# EAGLE design TelTail Breakout 3v0 (EAGLE 9.6.2)
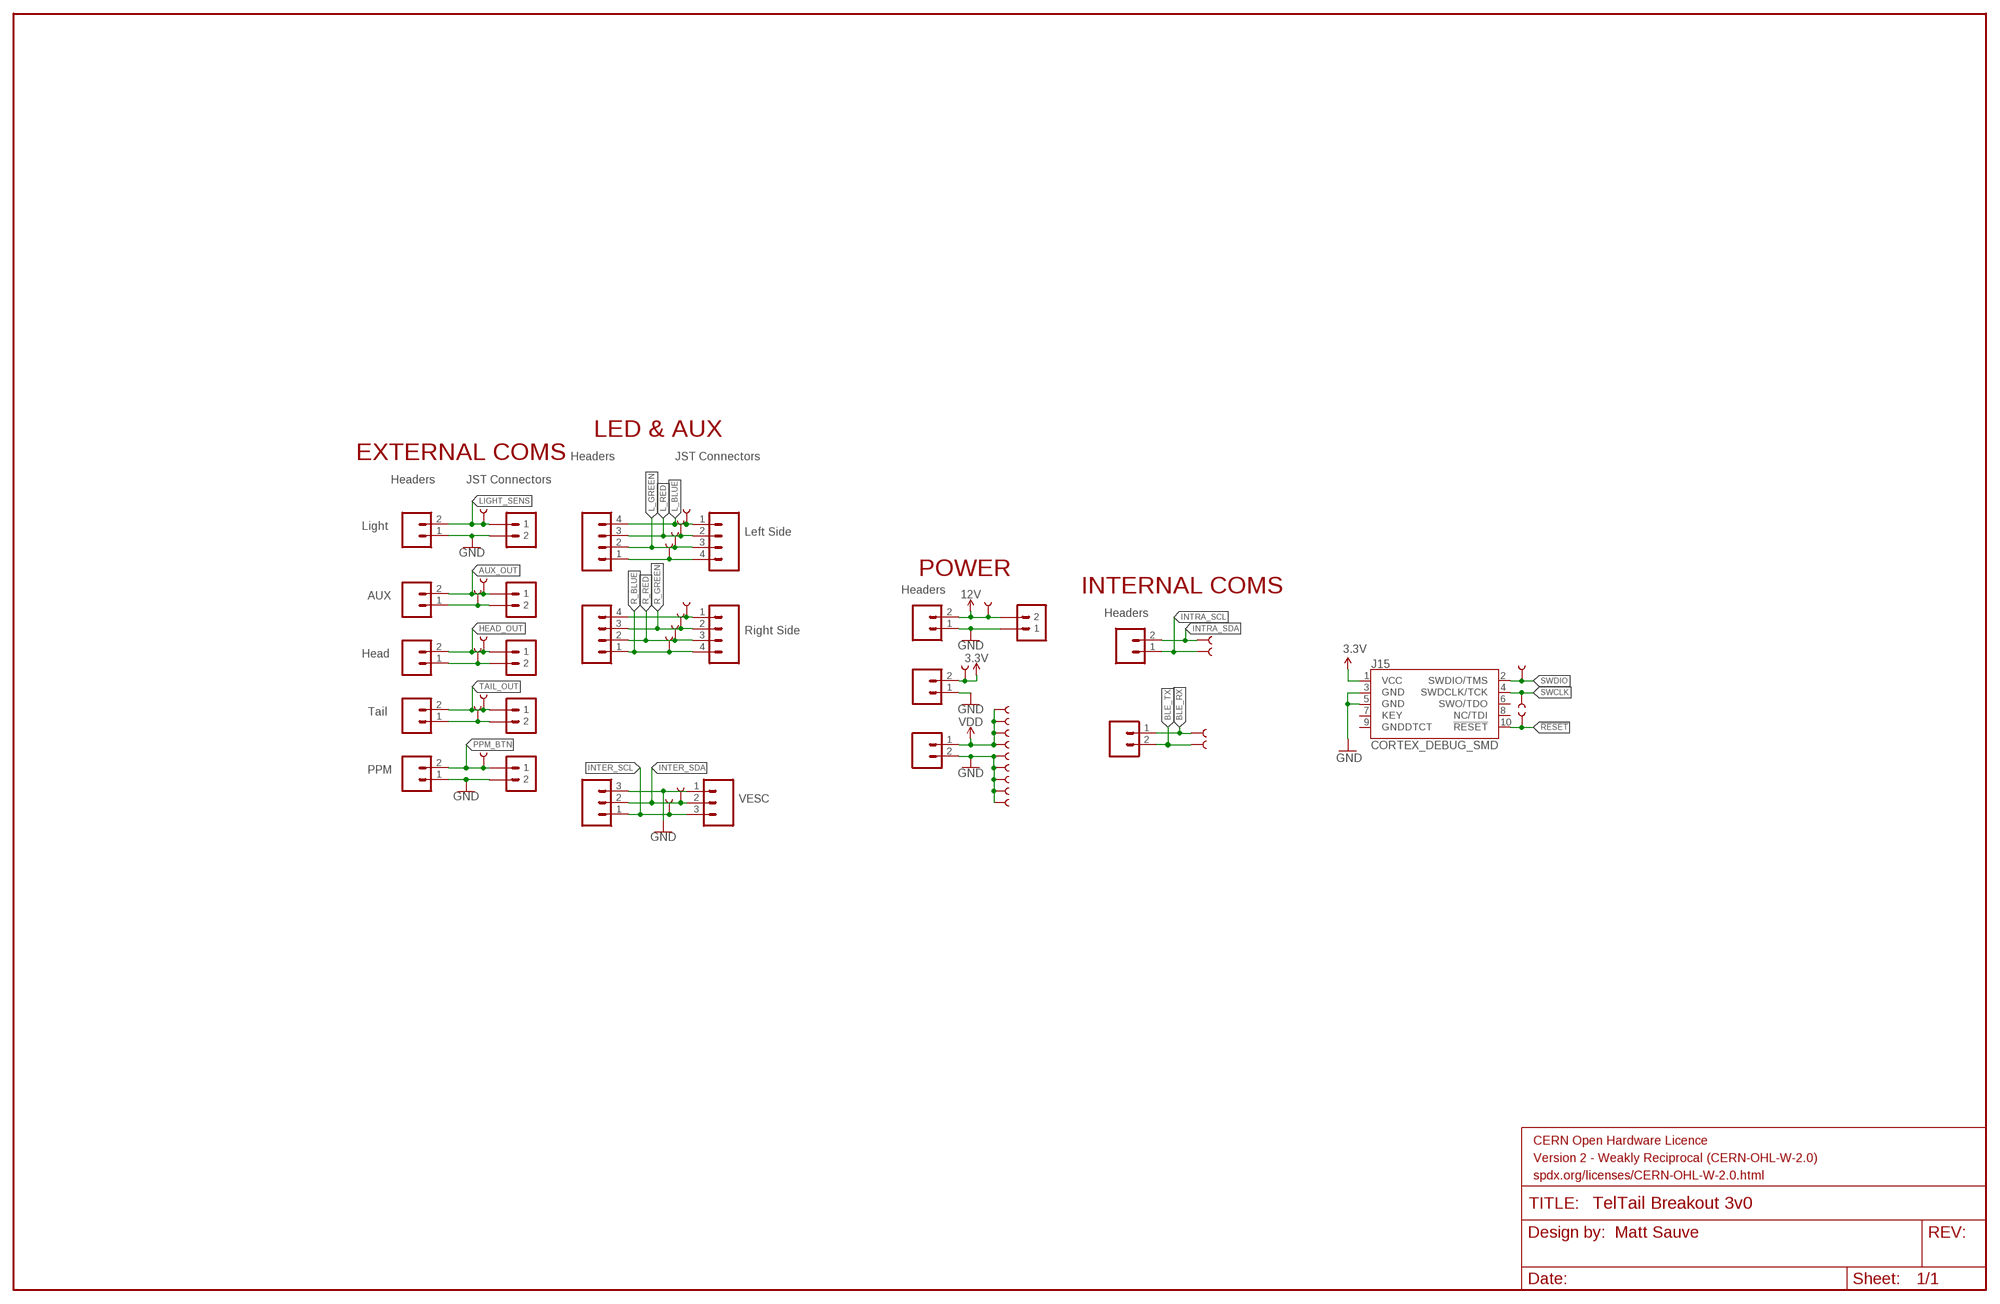
[diagram p0: schematic, sheet 1]

## Parts
FRAME1  FRAME-LEDGER_CERN_WEAK  [CERN_WEAK]
J1  CONN_02  [1X02]
J2  CONN_02  [1X02]
J3  CONN_02  [1X02]
J4  CONN_02  [1X02]
J5  CONN_02  [1X02]
J6  CONN_02  [1X02]
J7  CONN_03  [1X03]
J9  CONN_04  [1X04]
J10  CONN_04  [1X04]
J11  CONN_02  [1X02]
J12  CONN_02  [1X02]
J13  CONN_02  [1X02]
J14  CONN_02  [1X02]
J15  CORTEX_DEBUG_SMD  [SAMTECH_FTSH-105-01]
U$1  JST_PH_2POS  [JST_PH_2POS]
U$2  JST_PH_2POS  [JST_PH_2POS]
U$3  JST_PH_2POS  [JST_PH_2POS]
U$4  JST_PH_2POS  [JST_PH_2POS]
U$5  JST_PH_2POS  [JST_PH_2POS]
U$6  POGO_PIN_90173-AS  [POGO_PIN_90173-AS]
U$8  JST_PH_4POS  [JST_PH_4POS]
U$9  JST_PH_3POS  [JST_PH_3POS]
U$10  JST_PH_4POS  [JST_PH_4POS]
U$11  POGO_PIN_90173-AS  [POGO_PIN_90173-AS]
U$12  POGO_PIN_90173-AS  [POGO_PIN_90173-AS]
U$13  POGO_PIN_90173-AS  [POGO_PIN_90173-AS]
U$14  POGO_PIN_90173-AS  [POGO_PIN_90173-AS]
U$15  POGO_PIN_90173-AS  [POGO_PIN_90173-AS]
U$16  POGO_PIN_90173-AS  [POGO_PIN_90173-AS]
U$17  POGO_PIN_90173-AS  [POGO_PIN_90173-AS]
U$18  POGO_PIN_90173-AS  [POGO_PIN_90173-AS]
U$19  POGO_PIN_90173-AS  [POGO_PIN_90173-AS]
U$20  POGO_PIN_90173-AS  [POGO_PIN_90173-AS]
U$21  POGO_PIN_90173-AS  [POGO_PIN_90173-AS]
U$22  POGO_PIN_90173-AS  [POGO_PIN_90173-AS]
U$23  POGO_PIN_90173-AS  [POGO_PIN_90173-AS]
U$24  POGO_PIN_90173-AS  [POGO_PIN_90173-AS]
U$25  POGO_PIN_90173-AS  [POGO_PIN_90173-AS]
U$26  POGO_PIN_90173-AS  [POGO_PIN_90173-AS]
U$27  POGO_PIN_90173-AS  [POGO_PIN_90173-AS]
U$28  POGO_PIN_90173-AS  [POGO_PIN_90173-AS]
U$29  POGO_PIN_90173-AS  [POGO_PIN_90173-AS]
U$30  POGO_PIN_90173-AS  [POGO_PIN_90173-AS]
U$31  POGO_PIN_90173-AS  [POGO_PIN_90173-AS]
U$32  POGO_PIN_90173-AS  [POGO_PIN_90173-AS]
U$33  POGO_PIN_90173-AS  [POGO_PIN_90173-AS]
U$34  POGO_PIN_90173-AS  [POGO_PIN_90173-AS]
U$35  POGO_PIN_90173-AS  [POGO_PIN_90173-AS]
U$36  POGO_PIN_90173-AS  [POGO_PIN_90173-AS]
U$37  POGO_PIN_90173-AS  [POGO_PIN_90173-AS]
U$38  POGO_PIN_90173-AS  [POGO_PIN_90173-AS]
U$39  POGO_PIN_90173-AS  [POGO_PIN_90173-AS]
U$40  POGO_PIN_90173-AS  [POGO_PIN_90173-AS]
U$42  POGO_PIN_90173-AS  [POGO_PIN_90173-AS]
U$43  POGO_PIN_90173-AS  [POGO_PIN_90173-AS]
U$44  POGO_PIN_90173-AS  [POGO_PIN_90173-AS]
U$45  JST_PH_2POS  [JST_PH_2POS]
U$46  POGO_PIN_90173-AS  [POGO_PIN_90173-AS]
U$48  POGO_PIN_90173-AS  [POGO_PIN_90173-AS]

## Nets
3.3V: J12.2 J15.1(VCC) U$20.P$1
12V: J11.2 U$38.P$1 U$45.2
!RESET: J15.10(!RESET) U$36.P$1
AUX_OUT: J2.2 U$4.1 U$31.P$1
BLE_RX: J14.1 U$46.P$1
BLE_TX: J14.2 U$48.P$1
GND: J1.1 J5.1 J6.2 J7.3 J11.1 J12.1 J15.3(GND) J15.5(GND) U$1.2 U$5.2 U$6.P$1 U$9.1 U$24.P$1 U$28.P$1 U$30.P$1 U$40.P$1 U$45.1
HEAD_OUT: J3.2 U$3.1 U$29.P$1
INTER_SCL: J7.1 U$9.3 U$19.P$1
INTER_SDA: J7.2 U$9.2 U$21.P$1
INTRA_SCL: J13.1 U$44.P$1
INTRA_SDA: J13.2 U$43.P$1
L_BLUE: J10.4 U$10.1 U$11.P$1
L_GREEN: J10.2 U$10.3 U$13.P$1
L_RED: J10.3 U$10.2 U$12.P$1
LIGHT_SENS: J1.2 U$5.1 U$33.P$1
N$1: J4.1 U$2.2 U$35.P$1
N$2: J3.1 U$3.2 U$34.P$1
N$3: J2.1 U$4.2 U$32.P$1
N$4: J10.1 U$10.4 U$14.P$1
N$5: J9.4 U$8.1 U$15.P$1
PPM_BTN: J5.2 U$1.1 U$25.P$1
R_BLUE: J9.1 U$8.4 U$18.P$1
R_GREEN: J9.3 U$8.2 U$16.P$1
R_RED: J9.2 U$8.3 U$17.P$1
SWCLK: J15.4(SWDCLK/TCK) U$37.P$1
SWDIO: J15.2(SWDIO/TMS) U$39.P$1
TAIL_OUT: J4.2 U$2.1 U$27.P$1
VDD: J6.1 U$22.P$1 U$23.P$1 U$26.P$1 U$42.P$1
Unconnected: J15.6(SWO/TDO) J15.7(KEY) J15.8(NC/TDI) J15.9(GNDDTCT)

## Notes on the sheet
- LED & AUX
- EXTERNAL COMS | Headers | JST Connectors
- Headers | JST Connectors
- Light
- Left Side
- POWER
- Headers | INTERNAL COMS
- AUX
- Headers
- Right Side
- Head
- Tail
- PPM
- VESC
- Matt Sauve

## Library data of the parts
FRAME1 = SAUVE:FRAME-LEDGER_CERN_WEAK: Schematic Frame - Ledger Standard 11x14 US Ledger frame
J1-J6 J11-J14 = SparkFun-Connectors:CONN_02: Multi connection point. Often used as Generic Header-pin footprint for 0.1 inch spaced/style header connections On any of the 0.1 inch spaced packages, you can populate with these: Break Away Headers - Straight <https://www.sparkfun.com/products/116> (PRT-00116) Break Away Male Headers - Right Angle <https://www.sparkfun.com/products/553> (PRT-00553) Female Headers <https://www.sparkfun.com/products/115> (PRT-00115) Break Away Headers - Machine Pin <https://www.sparkfun.com/products/117> (PRT-00117) Break Away Female Headers - Swiss Machine Pin <https://www.sparkfun.com/products/743> (PRT-00743) For SCREWTERMINALS and SPRING TERMINALS visit here: Screw Terimnals on SparkFun.com <https://www.sparkfun.com/search/results?term=Screw+Terminals> (5mm/3.5mm/2.54mm spacing) This device is also useful as a general connection point to wire up your design to another part of your project. Our various solder wires solder well into these plated through hole pads. Hook-Up Wire - Assortment (Stranded, 22 AWG) <https://www.sparkfun.com/products/11375> (PRT-11375) Hook-Up Wire - Assortment (Solid Core, 22 AWG) <https://www.sparkfun.com/products/11367> (PRT-11367) View the entire wire category on our website here <https://www.sparkfun.com/categories/141> Special notes: Molex polarized connector foot print use with: PRT-08233 with associated crimp pins and housings. 2.54_SCREWTERM for use with PRT-10571. 3.5mm Screw Terminal footprints for PRT-08084 5mm Screw Terminal footprints for use with PRT-08432
J7 = SparkFun-Connectors:CONN_03: Multi connection point. Often used as Generic Header-pin footprint for 0.1 inch spaced/style header connections On any of the 0.1 inch spaced packages, you can populate with these: Break Away Headers - Straight <https://www.sparkfun.com/products/116> (PRT-00116) Break Away Male Headers - Right Angle <https://www.sparkfun.com/products/553> (PRT-00553) Female Headers <https://www.sparkfun.com/products/115> (PRT-00115) Break Away Headers - Machine Pin <https://www.sparkfun.com/products/117> (PRT-00117) Break Away Female Headers - Swiss Machine Pin <https://www.sparkfun.com/products/743> (PRT-00743) Stackable Header - 3 Pin (Female, 0.1") <https://www.sparkfun.com/products/13875> (PRT-13875) For SCREWTERMINALS and SPRING TERMINALS visit here: Screw Terimnals on SparkFun.com <https://www.sparkfun.com/search/results?term=Screw+Terminals> (5mm/3.5mm/2.54mm spacing) This device is also useful as a general connection point to wire up your design to another part of your project. Our various solder wires solder well into these plated through hole pads. Hook-Up Wire - Assortment (Stranded, 22 AWG) <https://www.sparkfun.com/products/11375> (PRT-11375) Hook-Up Wire - Assortment (Solid Core, 22 AWG) <https://www.sparkfun.com/products/11367> (PRT-11367) View the entire wire category on our website here <https://www.sparkfun.com/categories/141> Special notes: Molex polarized connector foot print use with SKU : PRT-08232 with associated crimp pins and housings.
J9 J10 = SparkFun-Connectors:CONN_04: Multi connection point. Often used as Generic Header-pin footprint for 0.1 inch spaced/style header connections On any of the 0.1 inch spaced packages, you can populate with these: Break Away Headers - Straight <https://www.sparkfun.com/products/116> (PRT-00116) Break Away Male Headers - Right Angle <https://www.sparkfun.com/products/553> (PRT-00553) Female Headers <https://www.sparkfun.com/products/115> (PRT-00115) Break Away Headers - Machine Pin <https://www.sparkfun.com/products/117> (PRT-00117) Break Away Female Headers - Swiss Machine Pin <https://www.sparkfun.com/products/743> (PRT-00743) For SCREWTERMINALS and SPRING TERMINALS visit here: Screw Terimnals on SparkFun.com <https://www.sparkfun.com/search/results?term=Screw+Terminals> (5mm/3.5mm/2.54mm spacing) This device is also useful as a general connection point to wire up your design to another part of your project. Our various solder wires solder well into these plated through hole pads. Hook-Up Wire - Assortment (Stranded, 22 AWG) <https://www.sparkfun.com/products/11375> (PRT-11375) Hook-Up Wire - Assortment (Solid Core, 22 AWG) <https://www.sparkfun.com/products/11367> (PRT-11367) View the entire wire category on our website here <https://www.sparkfun.com/categories/141> Special notes: Molex polarized connector foot print use with SKU : PRT-08231 with associated crimp pins and housings. 1MM SMD Version SKU: PRT-10208; PROD_ID: CONN-09696
J15 = SparkFun-Connectors:CORTEX_DEBUG: Cortex Debug Connector - 10 pin Supports JTAG debug, Serial Wire debug, and Serial Wire Viewer. PTH and SMD connector options available. General Connector Information <http://infocenter.arm.com/help/topic/com.arm.doc.faqs/attached/13634/cortex_debug_connectors.pdf> Products: PTH Connector <http://www.digikey.com/product-detail/en/cnc-tech/3220-10-0100-00/1175-1627-ND/3883661> -via Digi-Key SparkFun PSoc <https://www.sparkfun.com/products/13229> SparkFun T <https://www.sparkfun.com/products/13810>
U$1-U$5 U$45 = SAUVE:JST_PH_2POS
U$6 U$11-U$40 U$42-U$44 U$46 U$48 = SAUVE:POGO_PIN_90173-AS
U$8 U$10 = SAUVE:JST_PH_4POS
U$9 = SAUVE:JST_PH_3POS

## Board
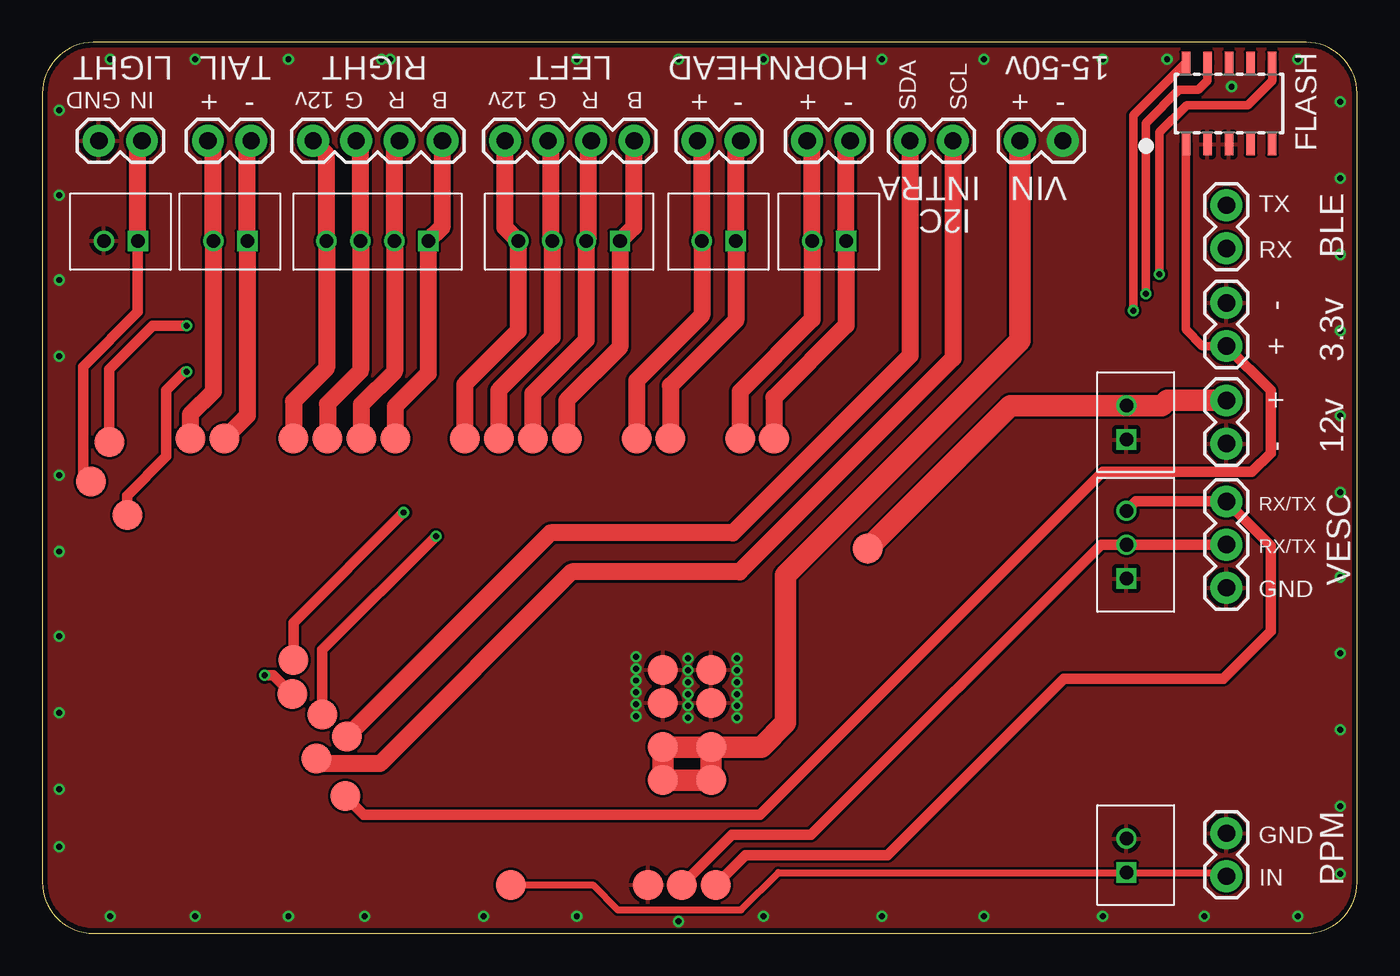
[diagram p1: board, top side]
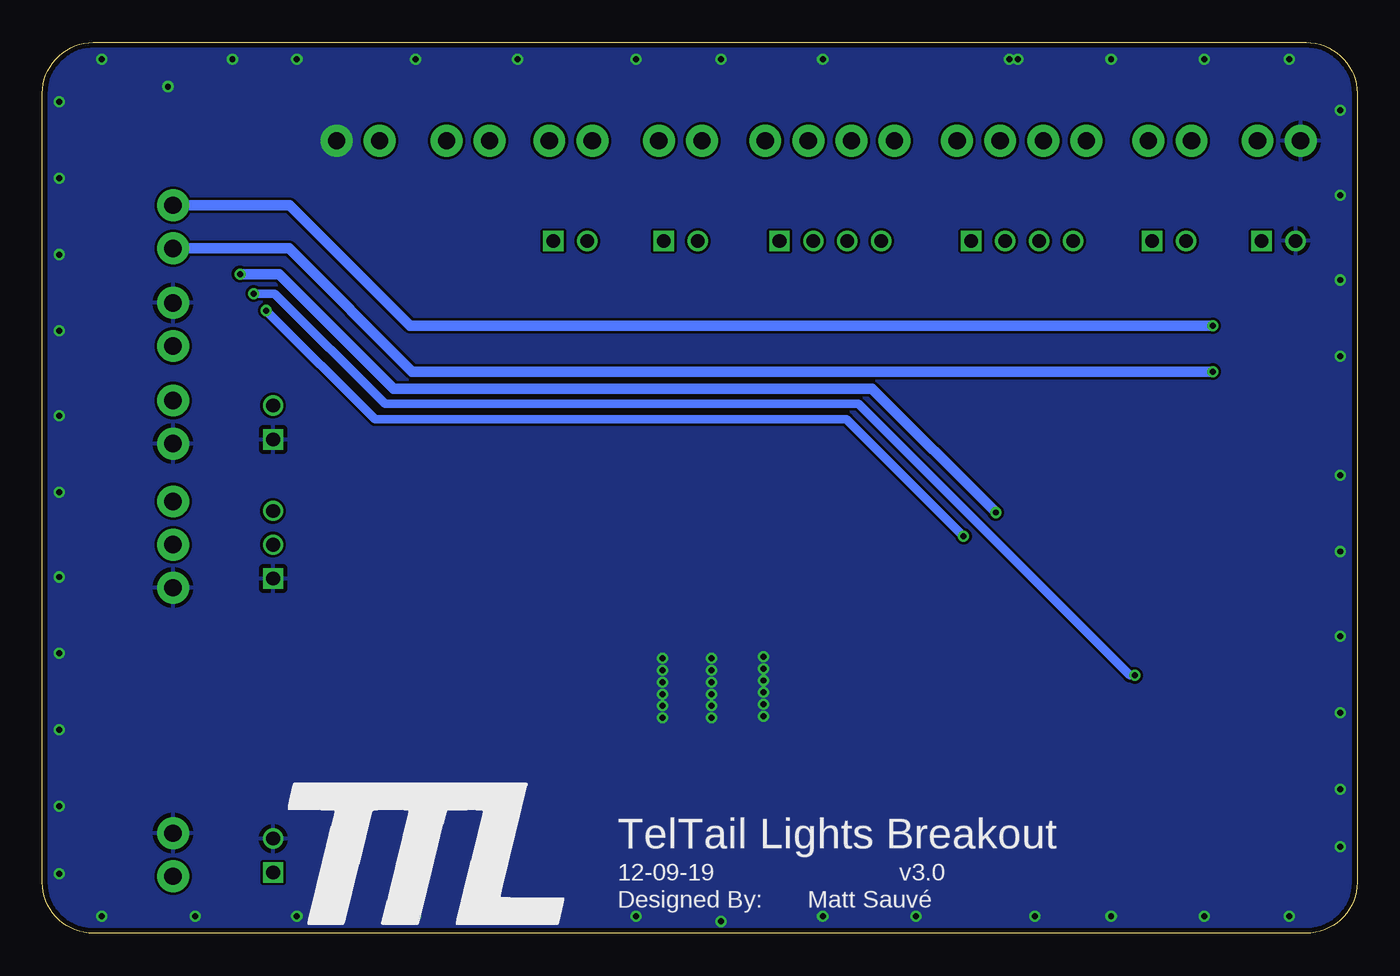
[diagram p2: board, bottom side, seen from below]

Size 77.5 x 52.5 mm. Coordinates in mm from the lower left corner, seen from the top.
Outline: 74.5,52.5 3,52.5 arc90 0,49.5 0,3 arc90 3,0 74.5,0 arc90 77.5,3 77.5,49.5 arc90 74.5,52.5
Copper layers (1*16): Top 0.035mm / dielectric 1.5mm / Bottom 0.035mm
Design rules "ALLPCB": minimum track width 6mil, minimum drill 12mil, track to track 6mil, track to pad 6mil, pad to pad 6mil, via to via 6mil, smd to smd 6mil, copper to edge 12mil, drill to drill 12mil, minimum pad ring 7mil, minimum via ring 6mil, stop-mask expansion 0mil, vias tented up to drill 0.35mm, thermal gap 10mil

### Footprints (pad centres in the part's own frame; a part is rotated, then mirrored left to right if it is on the bottom)
1X02 = drill 1.016 pad 1.88: 1 0,0; 2 2.54,0
1X03 = drill 1.016 pad 1.88: 1 0,0; 2 2.54,0; 3 5.08,0
1X04 = drill 1.016 pad 1.88: 1 0,0; 2 2.54,0; 3 5.08,0; 4 7.62,0
SAMTECH_FTSH-105-01 = smd 0.508 x 1.27: 1 -2.54,-2.413; 2 -2.54,2.413; 3 -1.27,-2.413; 4 -1.27,2.413; 5 0,-2.413; 6 0,2.413; 7 1.27,-2.413; 8 1.27,2.413; 9 2.54,-2.413; 10 2.54,2.413
JST_PH_2POS = drill 0.8 square: 1 -1.028,0 | drill 0.8: 2 0.972,0
POGO_PIN_90173-AS = smd 1.76 x 1.76: P$1 0,0
JST_PH_4POS = drill 0.8 square: 1 -3,0 | drill 0.8: 2 -1,0; 3 1,0; 4 3,0
JST_PH_3POS = drill 0.8 square: 1 -2,0 | drill 0.8: 2 0,0; 3 2,0

### Placement (x,y rotation side)
FRAME1  0.5,-8 0 top  (outside the outline)
J1  3.33,46.7 0 top
J2  45.08,46.7 0 top
J3  38.62,46.7 0 top
J4  9.76,46.7 0 top
J5  69.8,5.9 270 top
J6  57.62,46.7 0 top
J7  69.8,25.45 270 top
J9  15.96,46.7 0 top
J10  27.27,46.7 0 top
J11  69.8,28.86 90 top
J12  69.8,37.15 270 top
J13  53.68,46.7 180 top
J14  69.8,42.9 270 top
J15  69.95,48.9 0 top
U$1  63.9,4.61 90 top
U$2  11.05,40.8 180 top
U$3  39.85,40.8 180 top
U$4  46.35,40.8 180 top
U$5  4.6,40.8 180 top
U$6  36.58,15.53 0 top
U$8  19.75,40.8 180 top
U$9  63.9,22.9 90 top
U$10  31.05,40.8 180 top
U$11  30.9,29.15 0 top
U$12  28.9,29.15 0 top
U$13  26.9,29.15 0 top
U$14  24.9,29.15 0 top
U$15  20.8,29.15 0 top
U$16  18.8,29.15 0 top
U$17  16.8,29.15 0 top
U$18  14.8,29.15 0 top
U$19  39.7,2.85 0 top
U$20  17.85,8.1 0 top
U$21  37.7,2.85 0 top
U$22  39.42,10.97 0 top
U$23  36.58,10.97 0 top
U$24  36.58,13.57 0 top
U$25  27.6,2.85 0 top
U$26  39.42,9.03 0 top
U$27  10.72,29.15 0 top
U$28  39.42,15.53 0 top
U$29  37.02,29.15 0 top
U$30  39.42,13.57 0 top
U$31  43.12,29.15 0 top
U$32  41.12,29.15 0 top
U$33  2.85,26.62 0 top
U$34  35.02,29.15 0 top
U$35  8.72,29.15 0 top
U$36  14.8,16.1 0 top
U$37  14.75,14.1 0 top
U$38  48.65,22.68 0 top
U$39  16.5,12.9 0 top
U$40  35.7,2.85 0 top
U$41  [TTL_LARGE]  63,0.5 0 bottom
U$42  36.58,9.03 0 top
U$43  17.95,11.6 0 top
U$44  16.15,10.3 0 top
U$45  63.9,30.12 90 top
U$46  3.95,28.95 0 top
U$48  5,24.65 0 top

### Tracks (layer width: path | path; a pad name or v marks a point on that pad's centre or on a via)
3.3V
  Top 0.508: J15.1 67.41,35.59 68.39,34.61 J12.2
  Top 0.61: J12.2 72.4,32.01 72.4,28.3 71.3,27.2 62.5,27.2 42.3,7 18.95,7 U$20.P$1
12V
  Top 1.27: U$38.P$1 57.07,31.1 U$45.2 66,31.1 66.31,31.4 J11.2
!RESET  (via drill 0.35)
  Top 0.508: J15.10 72.49,50.24 71.05,48.8 67.45,48.8 65.85,47.2 v65.85,38.85
  Top 0.61: U$36.P$1 14.8,18.3 v21.3,24.8
  Bottom 0.61: v21.3,24.8 28.6,32.1 56.8,32.1 63.55,38.85 v65.85,38.85
AUX_OUT
  Top 1.016: J2.2 47.38,46.46 U$4.1 47.38,35.83 43.12,31.57 U$31.P$1
BLE_RX  (via drill 0.35)
  Top 0.61: U$46.P$1 3.95,33.25 6.5,35.8 v8.5,35.8
  Bottom 0.61: v8.5,35.8 55.82,35.8 62.92,42.9 J14.1
BLE_TX  (via drill 0.35)
  Top 0.61: v8.5,33.1 8.4,33.1 7.3,32 7.3,28.1 5,25.8 U$48.P$1
  Bottom 0.61: v8.5,33.1 55.7,33.1 62.96,40.36 J14.2
GND  (via drill 0.35)
  other vias: 35,16.3 35,15.6 35,14.9 35,14.2 35,13.5 35,12.8 38.05,16.2 38.05,15.5 38.05,14.8 38.05,14.1 38.05,13.4 38.05,12.7 40.95,16.2 40.95,15.5 40.95,14.8 40.95,14.1 40.95,13.4 40.95,12.7 1,8.5 1,13 1,17.5 1,22.5 1,27 1,34 1,38.5 1,43.5 1,48.5 4,51.5 9,51.5 14.5,51.5 20.5,51.5 20,51.5 31.5,51.5 37.5,51.5 42.5,51.5 49.5,51.5 55.5,51.5 62.5,51.5 66.3,51.5 74,51.5 76.5,49 76.5,44.5 76.5,40 76.5,35.5 1,5.1 76.5,30.5 76.5,26 76.5,21 76.5,16.5 76.5,12 76.5,7.5 76.5,3.5 4,1 9,1 14.5,1 26,1 31.5,1 37.5,0.7 42.5,1 49.5,1 55.5,1 62.5,1 68.5,1 74,1 19,1 70.1,49.9
  pour Bottom: 0,3 0,49.5 arc-90 3,52.5 74.5,52.5 arc-90 77.5,49.5 77.5,3 arc-90 74.5,0 3,0 arc-90
  pour Top (rank 6): 0,3 0,49.5 arc-90 3,52.5 74.5,52.5 arc-90 77.5,49.5 77.5,3 arc-90 74.5,0 3,0 arc-90
  pour Top (no thermals): 58.9,48 58.9,45.4 61.5,45.4 61.5,48
  pour Bottom (no thermals): 58.9,48 58.9,45.4 61.5,45.4 61.5,48
HEAD_OUT
  Top 1.016: J3.2 40.88,46.42 U$3.1 40.88,36.13 37.02,32.27 U$29.P$1
INTER_SCL
  Top 0.61: U$9.3 64.45,25.45 J7.1 72.4,22.85 72.4,17.8 69.6,15 60.2,15 49.8,4.6 41.45,4.6 U$19.P$1
INTER_SDA
  Top 0.61: U$9.2 | U$9.2 J7.2 | U$21.P$1 40.65,5.8 45.3,5.8 62.41,22.91 U$9.2
INTRA_SCL
  Top 1.016: J13.1 53.68,33.88 41.1,21.3 31.2,21.3 19.9,10 16.45,10 U$44.P$1
INTRA_SDA
  Top 1.016: J13.2 51.14,34.04 40.7,23.6 29.95,23.6 U$43.P$1
L_BLUE
  Top 1.016: J10.4 34.85,46.66 34.85,41.6 U$10.1 34.05,34.55 30.9,31.4 U$11.P$1
L_GREEN
  Top 1.016: J10.2 29.95,46.56 29.95,40.9 U$10.3 30.05,35.15 26.9,32 U$13.P$1
L_RED
  Top 1.016: J10.3 32.15,46.5 32.15,40.9 U$10.2 32.05,34.95 28.9,31.8 U$12.P$1
LIGHT_SENS
  Top 0.61: U$33.P$1 2.4,27.07 2.4,33.4 5.63,36.63 U$5.1
  Top 1.016: J1.2 5.63,46.46 U$5.1
N$1
  Top 1.016: J4.1 10.08,46.38 U$2.2 10.08,31.93 8.72,30.57 U$35.P$1
N$2
  Top 1.016: J3.1 38.88,46.44 U$3.2 38.88,36.43 35.02,32.58 U$34.P$1
N$3
  Top 1.016: J2.1 45.38,46.4 U$4.2 45.38,36.18 41.12,31.93 U$32.P$1
N$4
  Top 1.016: J10.1 27.25,46.68 27.25,41.6 U$10.4 28.05,35.5 24.9,32.35 U$14.P$1
N$5
  Top 1.016: J9.4 23.55,46.67 23.55,41.6 U$8.1 22.75,33 20.8,31.05 U$15.P$1
PPM_BTN
  Top 0.406: J5.2 69.58,3.58 U$1.1 43.38,3.58 41.18,1.38 33.92,1.38 32.45,2.85 U$25.P$1
R_BLUE
  Top 1.016: J9.1 16.75,45.91 U$8.4 16.75,33.3 14.8,31.35 U$18.P$1
R_GREEN
  Top 1.016: J9.3 20.75,46.41 U$8.2 20.75,33.1 18.8,31.15 U$16.P$1
R_RED
  Top 1.016: J9.2 18.75,46.45 U$8.3 18.75,33.15 16.8,31.2 U$17.P$1
SWCLK  (via drill 0.35)
  Top 0.508: v65.05,37.7 65.05,47.75 67,49.7 68.15,49.7 68.68,50.23 J15.4
  Top 0.61: U$37.P$1 14.7,14.1 13.6,15.2 v13.1,15.2
  Bottom 0.508: v13.1,15.2 13.4,15.2 29.4,31.2 57.3,31.2 63.8,37.7 v65.05,37.7
SWDIO  (via drill 0.35)
  Top 0.508: J15.2 64.3,48.2 v64.3,36.7
  Top 0.61: v23.2,23.4 16.5,16.7 U$39.P$1
  Bottom 0.508: v23.2,23.4 30.1,30.3 57.9,30.3 v64.3,36.7
TAIL_OUT
  Top 1.016: J4.2 12.08,46.48 U$2.1 12.08,30.5 U$27.P$1
VDD
  Top 1.27: J6.1 57.62,34.92 43.8,21.1 43.8,12.4 42.38,10.97 U$22.P$1 | U$22.P$1 U$26.P$1 U$42.P$1 U$23.P$1 U$22.P$1

### Text on the board
tPlace: LIGHT | TAIL | RIGHT | LEFT | HEAD | HORN | 15-50v | GND | IN | 12v | G | R | B | 12v | G | R | B | + | - | + | - | + | - | SDA | SCL | + | - | FLASH | I2C / INTRA | VIN | TX | RX | BLE | - | + | 3.3v | + | - | 12v | RX/TX | RX/TX | GND | VESC | GND | IN | PPM
bPlace: TelTail Lights Breakout | v3.0 | 12-09-19 | Matt Sauvé | Designed By: